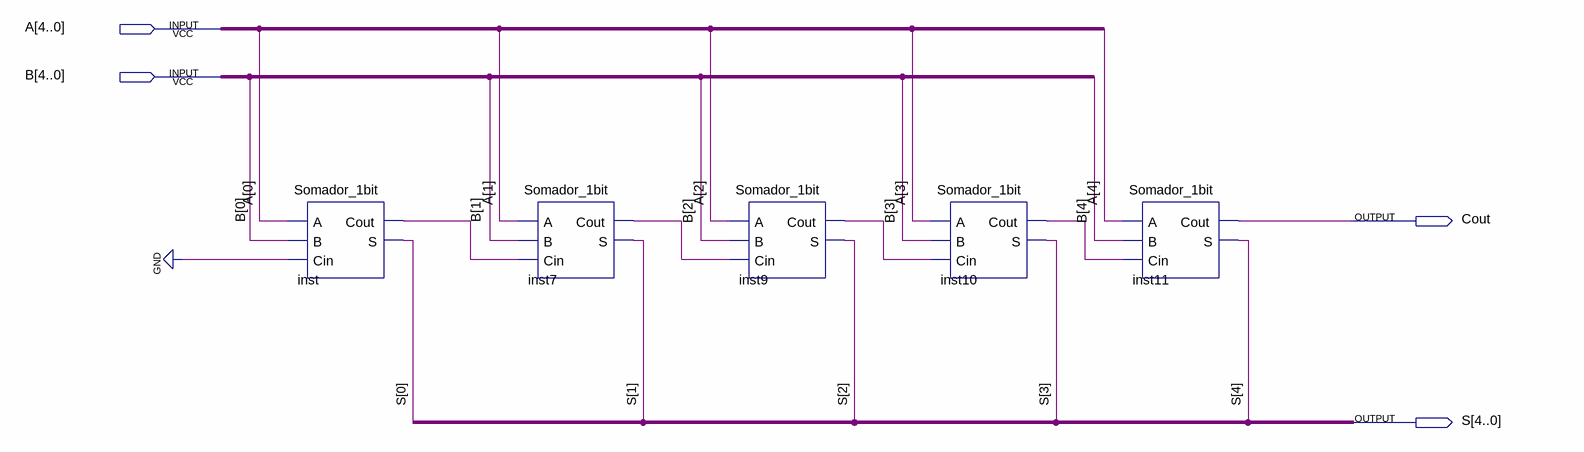
[diagram p0: schematic sheet]
// Quartus schematic Somador_5bits.bdf as structural Verilog: 5 symbols, 4 pins
module Somador_5bits (
  input  [4:0] A,
  input  [4:0] B,
  output Cout,
  output [4:0] S
);

  wire inst7_cout, inst9_cout, inst10_cout, inst_cout;

  Somador_1bit inst (.A(A[0]), .B(B[0]), .Cin(1'b0), .Cout(inst_cout), .S(S[0]));
  Somador_1bit inst7 (.A(A[1]), .B(B[1]), .Cin(inst_cout), .Cout(inst7_cout), .S(S[1]));
  Somador_1bit inst9 (.A(A[2]), .B(B[2]), .Cin(inst7_cout), .Cout(inst9_cout), .S(S[2]));
  Somador_1bit inst10 (.A(A[3]), .B(B[3]), .Cin(inst9_cout), .Cout(inst10_cout), .S(S[3]));
  Somador_1bit inst11 (.A(A[4]), .B(B[4]), .Cin(inst10_cout), .Cout(Cout), .S(S[4]));
endmodule
